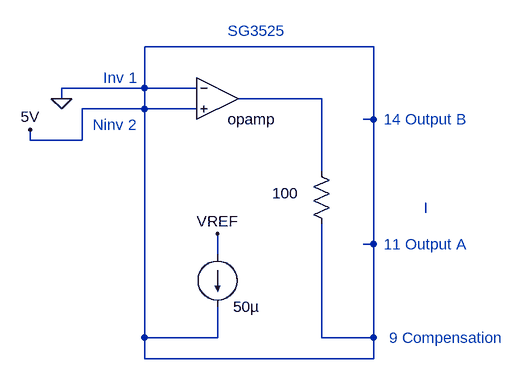
[diagram p0: schematic 03_magnum_power_vip_4000_test_circuit.asc]
03_magnum_power_vip_4000_test_circuit.asc, the LTspice schematic file:
Version 4
SHEET 1 2044 2052
WIRE 368 496 16 496
WIRE 16 560 16 496
WIRE 16 560 -112 560
WIRE 96 560 16 560
WIRE -112 576 -112 560
WIRE 288 576 160 576
WIRE 16 592 16 560
WIRE 16 592 -80 592
WIRE 96 592 16 592
WIRE 368 608 368 496
WIRE 368 608 352 608
WIRE -160 640 -160 624
WIRE -80 640 -80 592
WIRE -80 640 -160 640
WIRE 288 688 288 576
WIRE 448 752 448 736
WIRE 368 800 368 608
WIRE 368 800 352 800
WIRE 128 816 128 784
WIRE 16 944 16 592
WIRE 128 944 128 896
WIRE 128 944 16 944
WIRE 288 944 288 768
WIRE 368 944 368 800
WIRE 368 944 288 944
WIRE 16 976 16 944
WIRE 368 976 368 944
WIRE 368 976 16 976
FLAG 128 784 VREF
FLAG -112 576 0
FLAG -160 624 5V
SYMBOL current 128 816 R0
WINDOW 0 24 0 Invisible 2
SYMATTR InstName I1
SYMATTR Value 50µ
SYMBOL res 304 784 R180
WINDOW 0 36 76 Invisible 2
WINDOW 3 51 62 Left 2
SYMATTR InstName R1
SYMATTR Value 100
SYMBOL Opamps\\opamp 128 512 R0
WINDOW 0 0 32 Invisible 2
SYMATTR InstName U1
TEXT -48 544 Left 2 ;Inv 1
TEXT -64 616 Left 2 ;Ninv 2
TEXT 392 944 Left 2 ;9 Compensation
TEXT 384 800 Left 2 ;11 Output A
TEXT 384 608 Left 2 ;14 Output B
TEXT 144 472 Left 2 ;SG3525

The netlist it stands for:
* 03_magnum_power_vip_4000_test_circuit.asc
I1 VREF 0 50µ
R1 0 N001 100
XU1 0 0 N001 opamp Aol=100K GBW=10Meg  ; pins invin noninvin out
* Inv 1
* Ninv 2
* 9 Compensation
* 11 Output A
* 14 Output B
* SG3525
.backanno
.end